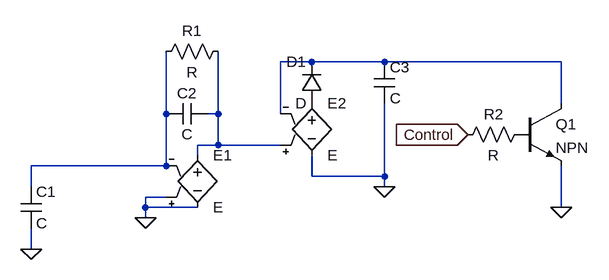
[diagram p0: schematic Draft1.asc]
Draft1.asc, the LTspice schematic file:
Version 4
SHEET 1 896 680
WIRE 464 -16 416 -16
WIRE 576 -16 464 -16
WIRE 848 -16 576 -16
WIRE 848 48 848 -16
WIRE 240 64 240 -32
WIRE 320 64 320 -32
WIRE 320 64 304 64
WIRE 416 64 416 -16
WIRE 320 112 320 64
WIRE 320 112 288 112
WIRE 416 112 320 112
WIRE 288 128 288 112
WIRE 240 144 240 64
WIRE 240 144 32 144
WIRE 464 160 464 128
WIRE 576 160 576 48
WIRE 576 160 464 160
WIRE 32 176 32 144
WIRE 576 176 576 160
WIRE 240 192 208 192
WIRE 208 208 208 192
WIRE 288 208 208 208
WIRE 848 208 848 144
WIRE 208 224 208 208
WIRE 32 272 32 240
FLAG 32 272 0
FLAG 208 224 0
FLAG 576 176 0
FLAG 848 208 0
FLAG 704 96 Control
IOPIN 704 96 In
SYMBOL cap 16 176 R0
SYMATTR InstName C1
SYMBOL e2 288 112 R0
SYMATTR InstName E1
SYMBOL cap 304 48 R90
WINDOW 0 0 32 VBottom 2
WINDOW 3 32 32 VTop 2
SYMATTR InstName C2
SYMBOL res 336 -48 R90
WINDOW 0 0 56 VBottom 2
WINDOW 3 32 56 VTop 2
SYMATTR InstName R1
SYMBOL e2 464 32 R0
SYMATTR InstName E2
SYMBOL diode 480 48 R180
WINDOW 0 24 64 Left 2
WINDOW 3 24 0 Left 2
SYMATTR InstName D1
SYMBOL cap 560 -16 R0
SYMATTR InstName C3
SYMBOL npn2 784 48 R0
SYMATTR InstName Q1
SYMBOL res 800 80 R90
WINDOW 0 0 56 VBottom 2
WINDOW 3 32 56 VTop 2
SYMATTR InstName R2

The netlist it stands for:
* Draft1.asc
C1 N002 0 C
E1 N003 0 0 N002 E
C2 N003 N002 C
R1 N003 N002 R
E2 P001 0 N003 N001 E
D1 P001 N001 D
C3 N001 0 C
Q1 N001 P002 0 0 NPN
R2 P002 Control R
.model D D
.lib standard.dio
.model NPN NPN
.model PNP PNP
.lib standard.bjt
.backanno
.end